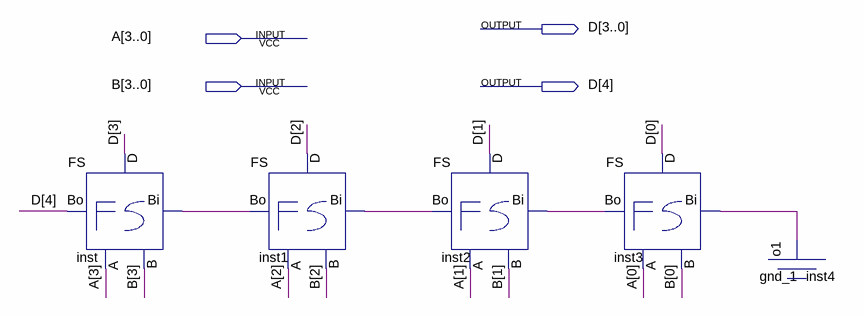
[diagram p0: schematic sheet]
// Quartus schematic FS4.bdf as structural Verilog: 5 symbols, 4 pins
module FS4 (
  input  [3:0] A,
  input  [3:0] B,
  output [4:0] D
);

  wire inst1_bo, inst2_bo, inst3_bo, inst4_o1;

  FS inst (.Bi(inst1_bo), .A(A[3]), .B(B[3]), .Bo(D[4]), .D(D[3]));
  FS inst1 (.Bi(inst2_bo), .A(A[2]), .B(B[2]), .Bo(inst1_bo), .D(D[2]));
  FS inst2 (.Bi(inst3_bo), .A(A[1]), .B(B[1]), .Bo(inst2_bo), .D(D[1]));
  FS inst3 (.Bi(inst4_o1), .A(A[0]), .B(B[0]), .Bo(inst3_bo), .D(D[0]));
  gnd_1 inst4 (.o1(inst4_o1));
endmodule
